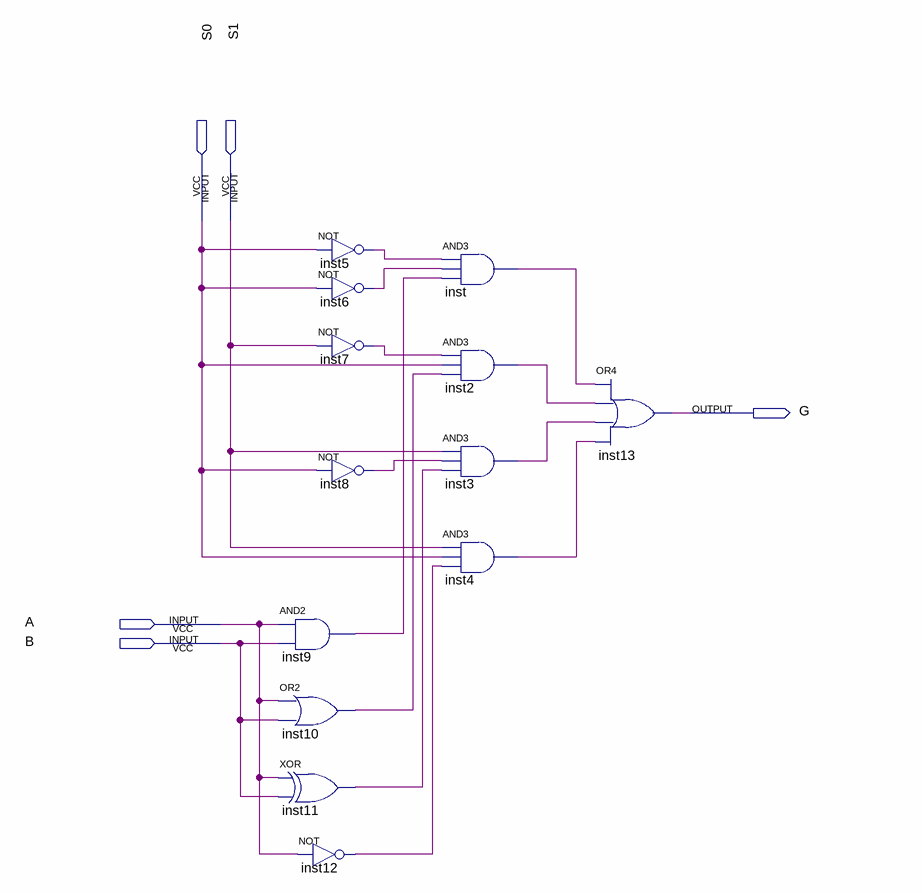
[diagram p0: schematic sheet]
// Quartus schematic Logic_Circuit.bdf as structural Verilog: 13 symbols, 5 pins
module Logic_Circuit (
  input  S0,
  input  S1,
  input  A,
  input  B,
  output G
);

  wire inst2_out, inst3_out, inst4_out, inst5_out, inst6_out, inst7_out, inst8_out, inst9_out, inst10_out,
       inst11_out, inst12_out, inst_out;

  not inst5 (inst5_out, S0);
  not inst6 (inst6_out, S0);
  not inst7 (inst7_out, S1);
  not inst8 (inst8_out, S0);
  and inst9 (inst9_out, A, B);
  or inst10 (inst10_out, A, B);
  xor inst11 (inst11_out, A, B);
  not inst12 (inst12_out, A);
  and inst (inst_out, inst5_out, inst6_out, inst9_out);
  and inst2 (inst2_out, inst7_out, S0, inst10_out);
  and inst3 (inst3_out, S1, inst8_out, inst11_out);
  and inst4 (inst4_out, S1, S0, inst12_out);
  or inst13 (G, inst_out, inst2_out, inst3_out, inst4_out);
endmodule
